# Altium schematic sheet Main.SchDoc
size A
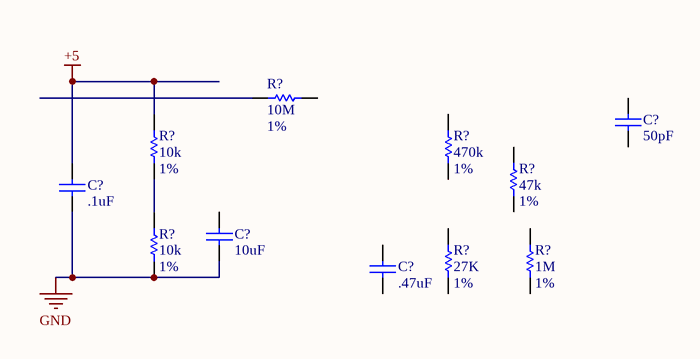
[diagram p0: Main.SchDoc]

## Parts
(Parts that share a designator on the sheet are numbered #1, #2 ... from top to bottom, then left to right.)
C?#1  50pF  [0805 (2012) Capacitor]
C?#2  .1uF  [0805 (2012) Capacitor]
C?#3  10uF  [0805 (2012) Capacitor]
C?#4  .47uF  [0805 (2012) Capacitor]
R?#1  value 10M  Tolerance: 1%  [R 0805 (2012) RESISTOR]  (hidden comment: 3.74K)
R?#2  Tolerance: 1%  [R 0805 (2012) RESISTOR]  (hidden comment: 10k)
R?#3  value 470k  Tolerance: 1%  [R 0805 (2012) RESISTOR]  (hidden comment: 3.74K)
R?#4  value 47k  Tolerance: 1%  [R 0805 (2012) RESISTOR]  (hidden comment: 3.74K)
R?#5  value 10k  Tolerance: 1%  [R 0805 (2012) RESISTOR]  (hidden comment: 3.74K)
R?#6  value 27K  Tolerance: 1%  [R 0805 (2012) RESISTOR]  (hidden comment: 3.74K)
R?#7  value 1M  Tolerance: 1%  [R 0805 (2012) RESISTOR]  (hidden comment: 3.74K)

## Nets
+5: C?#2.2 R?#2.2
GND: C?#2.1 C?#3.1 R?#5.2
NetR?#2_1: R?#2.1 R?#5.1

Not connected (* = marked no-connect by the designer): C?#1 1 2; C?#3 2; C?#4 1 2; R?#1 1 2; R?#3 1 2; R?#4 1 2; R?#6 1 2; R?#7 1 2

## Library data of the parts
C?#1 C?#2 C?#4 = Capacitor (non-polarized): Capacitor; Value: 10uF; Voltage Rating: 25 V
C?#3 = Capacitor (non-polarized): Capacitor; Voltage Rating: 25 V; Value: 10uF
R?#1-R?#7 = RES 0805 1K 1%
  R?#2: Value: 10k